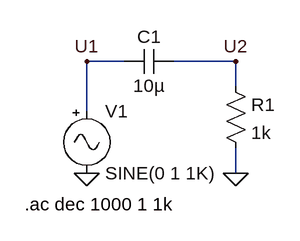
[diagram p0: schematic RC_high_pass.asc]
RC_high_pass.asc, the LTspice schematic file:
Version 4
SHEET 1 880 680
WIRE 176 -304 128 -304
WIRE 320 -304 240 -304
WIRE 320 -272 320 -304
WIRE 128 -240 128 -304
WIRE 320 -160 320 -192
FLAG 128 -160 0
FLAG 320 -160 0
FLAG 128 -304 U1
FLAG 320 -304 U2
SYMBOL Misc\\signal 128 -256 R0
WINDOW 39 0 0 Left 0
SYMATTR InstName V1
SYMATTR Value2 AC 1
SYMBOL cap 240 -320 R90
WINDOW 0 0 32 VBottom 2
WINDOW 3 32 32 VTop 2
SYMATTR InstName C1
SYMATTR Value 10µ
SYMBOL res 304 -288 R0
SYMATTR InstName R1
SYMATTR Value 1k
TEXT 48 -120 Left 2 !.ac dec 1000 1 1k

The netlist it stands for:
* RC_high_pass.asc
V1 U1 0 SINE(0 1 1K) AC 1
C1 U2 U1 10µ
R1 U2 0 1k
.ac dec 1000 1 1k
.backanno
.end